# EAGLE design splitter (EAGLE 9.2.2)
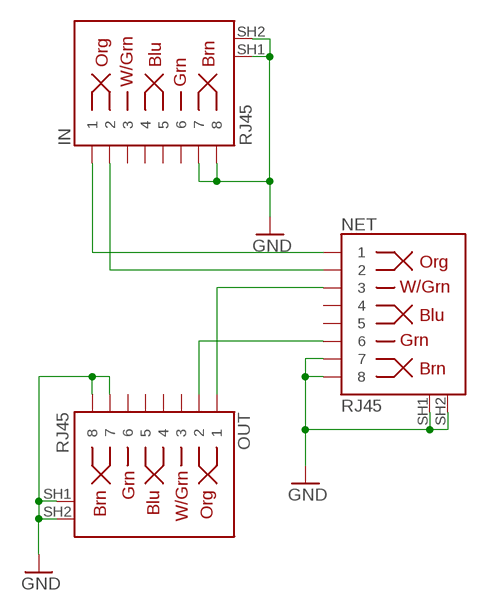
[diagram p0: schematic, sheet 1]

## Parts
IN  RJ45  RJ45-8  [RJ45-8]
NET  RJ45  RJ45-8  [RJ45-8]
OUT  RJ45  RJ45-8  [RJ45-8]

## Nets
GND: IN.7 IN.8 IN.SH1 IN.SH2 NET.7 NET.8 NET.SH1 NET.SH2 OUT.7 OUT.8 OUT.SH1 OUT.SH2
IN_A: IN.1 NET.1
IN_B: IN.2 NET.2
OUT_A: NET.3 OUT.1
OUT_B: NET.6 OUT.2
Unconnected: IN.3 IN.4 IN.5 IN.6 NET.4 NET.5 OUT.3 OUT.4 OUT.5 OUT.6

## Library data of the parts
IN NET OUT = SparkFun-Connectors-MyRJ:RJ45-8: RJ45 Jack - 8 pin Simple RJ45, 8-pin connection. Commonly used for Cat5, Cat5e, and Cat6 Ethernet cables. Here is the connector we sell at SparkFun: RJ45 8-Pin Connector <https://www.sparkfun.com/products/643> (PRT-00643) Datasheet <https://cdn.sparkfun.com/datasheets/Prototyping/04908.pdf> It is used on this SparkFun product: SparkFun RJ45 Breakout <https://www.sparkfun.com/products/716> (BOB-00716) Note, you may also be interested in the "MAGJACK" version of this. It is basically a RJ45 connector, but also has some status LEDs built into the connector housing. You can check that out in this library at the device named "MAGJACK.dev" and see these products online: RJ45 Ethernet MagJack-Compatible <https://www.sparkfun.com/products/8534> (PRT-08534) SparkFun RJ45 MagJack Breakout <https://www.sparkfun.com/products/13021> (BOB-13021); PROD_ID: CONN-08506; SF_ID: PRT-00643

## Board
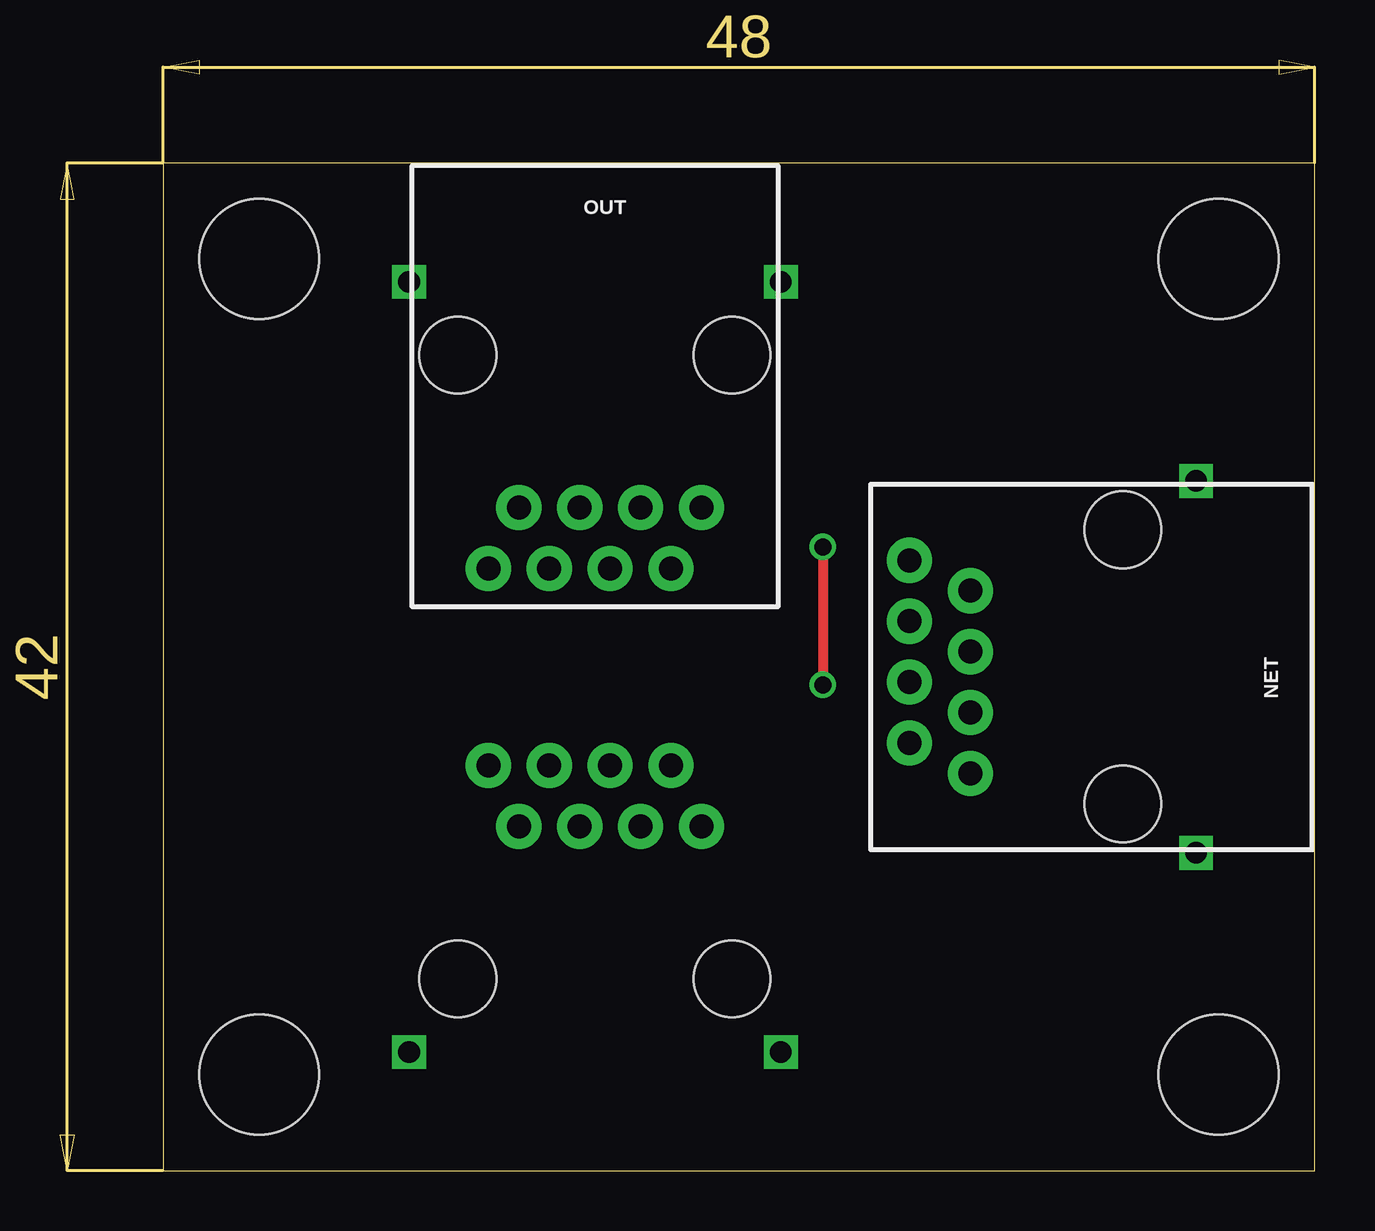
[diagram p1: board, top side]
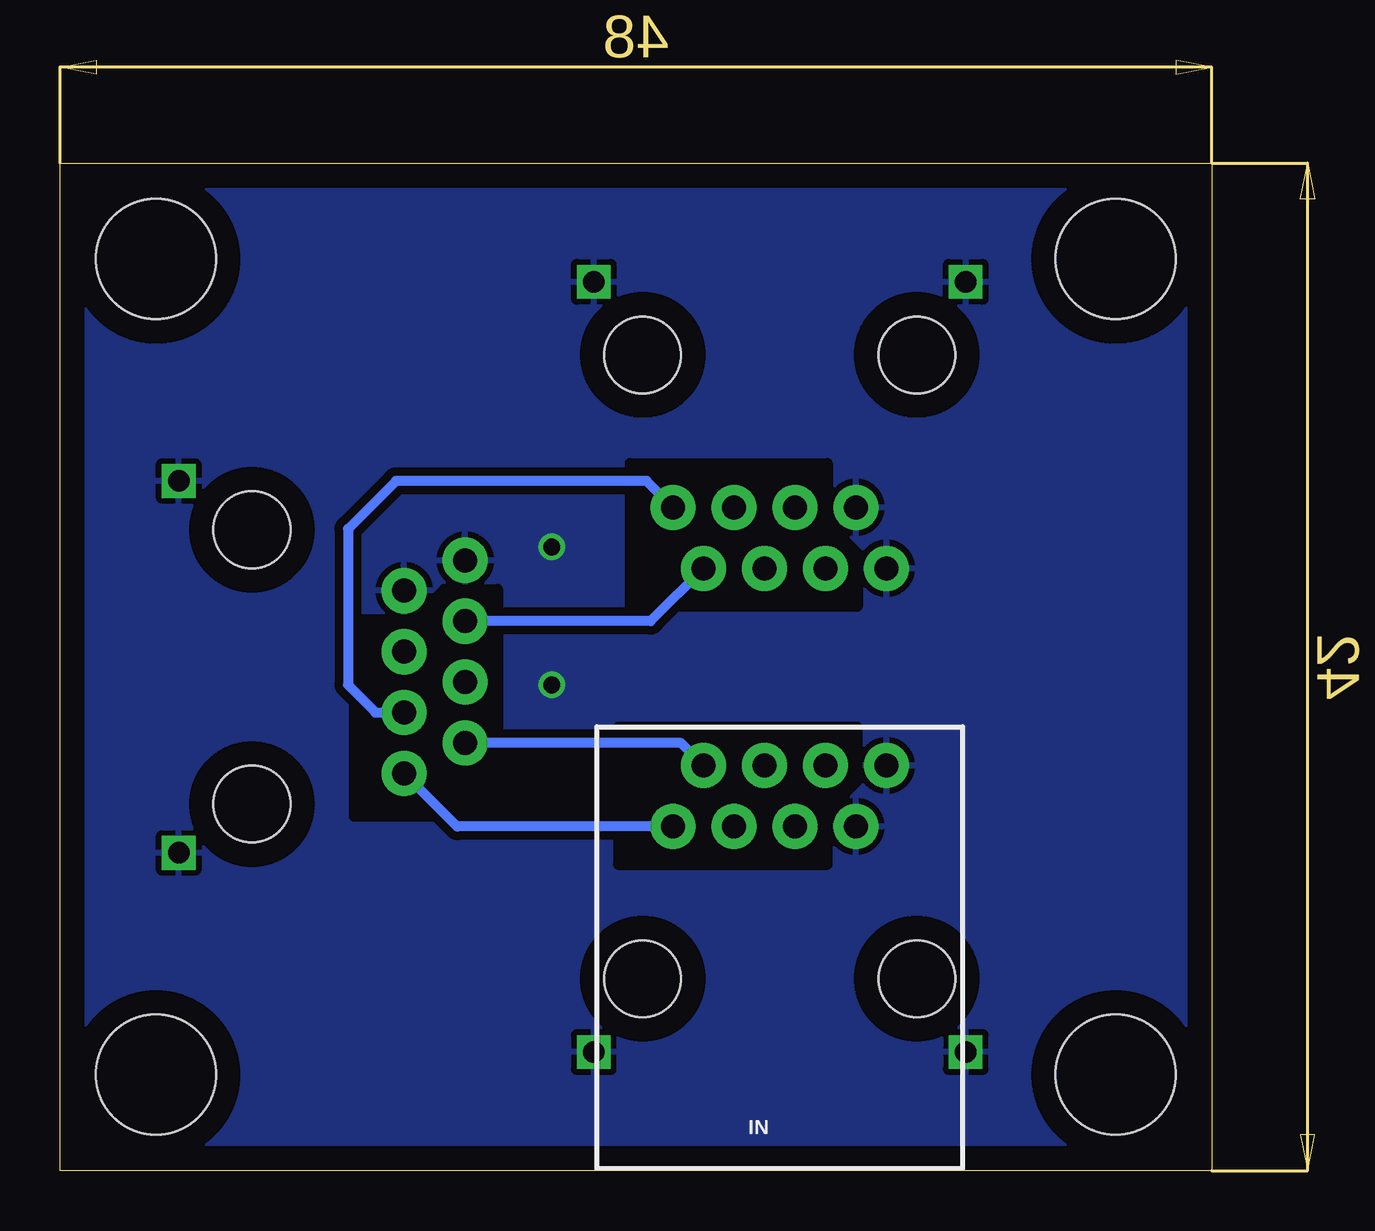
[diagram p2: board, bottom side, seen from below]

Size 48 x 42 mm. Coordinates in mm from the lower left corner, seen from the top.
Outline: 0,0 48,0 48,42 0,42 0,0
Copper layers (1*16): Top 0.035mm / dielectric 1.5mm / Bottom 0.035mm
Design rules "default *": minimum track width 16mil, minimum drill 0.35mm, track to track 14mil, track to pad 12mil, pad to pad 6mil, via to via 6mil, smd to smd 6mil, copper to edge 40mil, drill to drill 6mil, minimum pad ring 10mil, minimum via ring 8mil, stop-mask expansion 4mil, vias tented up to drill 0mil, thermal gap 10mil
Holes 5 mm at 4,4 4,38 44,38 44,4
bRestrict: area 14.8,23.5 to 24.2,29.5; area 29.8,14.8 to 35.8,24.2; area 14.8,12.8 to 24.8,18.5

### Footprints (pad centres in the part's own frame; a part is rotated, then mirrored left to right if it is on the bottom)
RJ45-8 = drill 1 pad 1.88: 1 -4.445,6.35; 2 -3.175,8.89; 3 -1.905,6.35; 4 -0.635,8.89; 5 0.635,6.35; 6 1.905,8.89; 7 3.175,6.35; 8 4.445,8.89 | drill 0.9 square: SH1 -7.75,-3.05; SH2 7.75,-3.05 | hole 3.2: -5.715,0; 5.715,0

### Placement (x,y rotation side)
IN  18,8 0 bottom
NET  40,21 90 top
OUT  18,34 180 top

### Tracks (layer width: path | path; a pad name or v marks a point on that pad's centre or on a via)
GND  (via drill 0.7)
  Top 0.406: v27.5,26 v27.5,20.25
  pour Bottom: 0,42 48,42 48,0 0,0
IN_A
  Bottom 0.406: IN.1 31.45,14.35 NET.1
IN_B
  Bottom 0.406: IN.2 22.11,17.82 NET.2
OUT_A
  Bottom 0.406: OUT.1 23.55,28.75 34,28.75 36,26.75 36,20.25 34.84,19.09 NET.3
OUT_B
  Bottom 0.406: OUT.2 23.38,22.91 NET.6